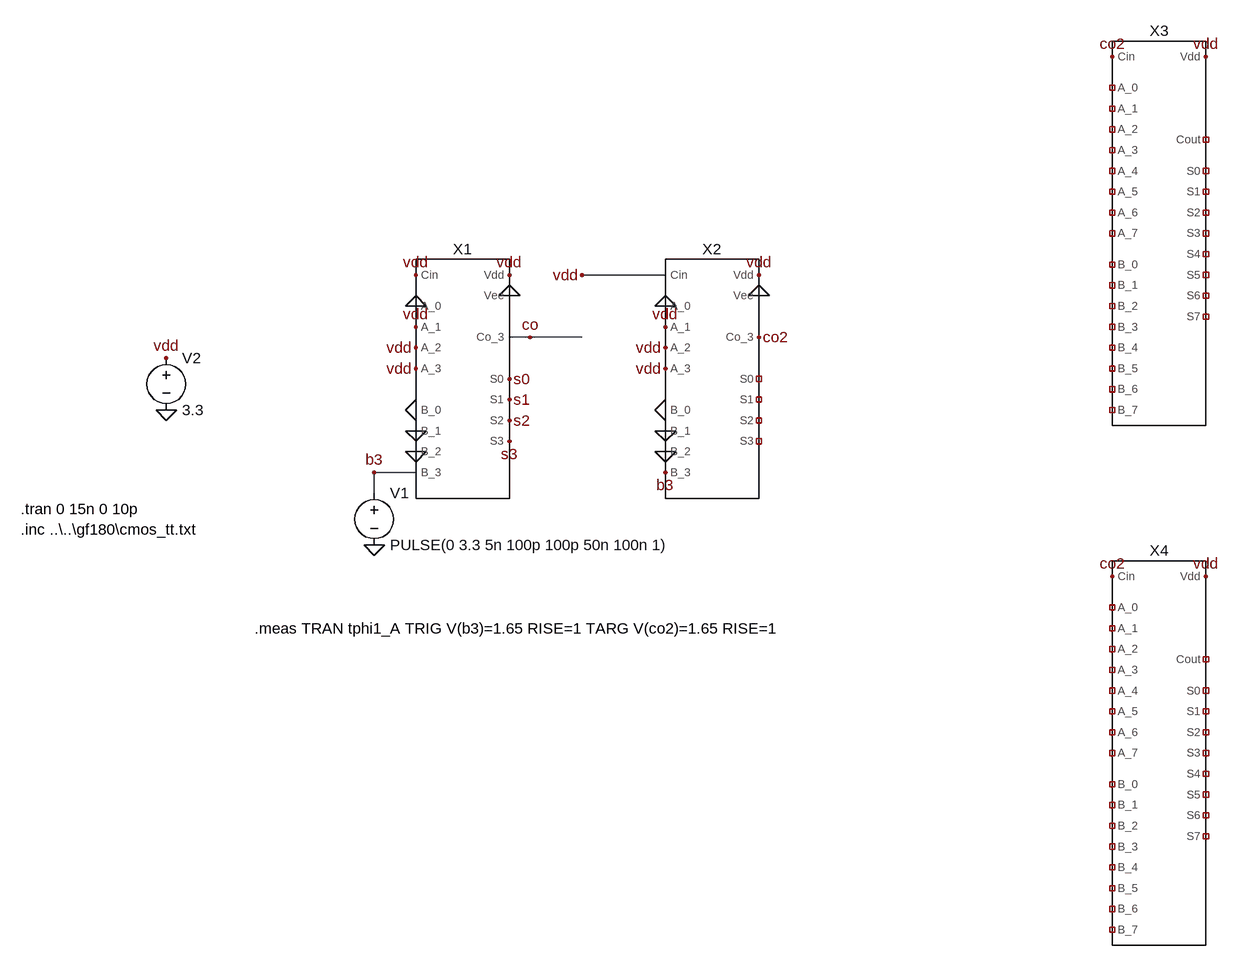
[diagram p0: schematic Draft4.asc]
Draft4.asc, the LTspice schematic file:
Version 4
SHEET 1 1308 988
WIRE 416 -48 288 -48
WIRE 208 48 176 48
WIRE 288 48 208 48
WIRE 32 256 -32 256
WIRE -32 288 -32 256
FLAG 176 -48 vdd
FLAG 176 -16 0
FLAG 208 48 co
FLAG 32 -48 vdd
FLAG 176 112 s0
FLAG 176 144 s1
FLAG 176 176 s2
FLAG 176 208 s3
FLAG 32 0 0
FLAG 32 32 vdd
FLAG 32 64 vdd
FLAG 32 96 vdd
FLAG 32 160 0
FLAG 32 192 0
FLAG 32 224 0
FLAG -32 368 0
FLAG -352 160 0
FLAG -352 80 vdd
FLAG 560 -48 vdd
FLAG 560 -16 0
FLAG 560 48 co2
FLAG 416 0 0
FLAG 416 32 vdd
FLAG 416 64 vdd
FLAG 416 96 vdd
FLAG 416 160 0
FLAG 416 192 0
FLAG 416 224 0
FLAG -32 256 b3
FLAG 416 256 b3
FLAG 288 -48 vdd
FLAG 1104 -384 co2
FLAG 1104 416 co2
FLAG 1248 -384 vdd
FLAG 1248 416 vdd
SYMBOL CLA-4bit 96 112 R0
SYMATTR InstName X1
SYMBOL voltage -32 272 R0
WINDOW 123 0 0 Left 0
WINDOW 39 0 0 Left 0
SYMATTR InstName V1
SYMATTR Value PULSE(0 3.3 5n 100p 100p 50n 100n 1)
SYMBOL voltage -352 64 R0
WINDOW 123 0 0 Left 0
WINDOW 39 0 0 Left 0
SYMATTR InstName V2
SYMATTR Value 3.3
SYMBOL CLA-4bit 480 112 R0
SYMATTR InstName X2
SYMBOL CLA-8bit 1168 -112 R0
SYMATTR InstName X3
SYMBOL CLA-8bit 1168 688 R0
SYMATTR InstName X4
TEXT -576 312 Left 2 !.tran 0 15n 0 10p
TEXT -576 344 Left 2 !.inc ..\\..\\gf180\\cmos_tt.txt
TEXT -216 496 Left 2 !.meas TRAN tphi1_A TRIG V(b3)=1.65 RISE=1 TARG V(co2)=1.65 RISE=1

The netlist it stands for:
* Draft4.asc
XX1 0 vdd vdd vdd 0 0 0 b3 vdd vdd 0 co s0 s1 s2 s3 CLA-4bit  ; pins A_0 A_1 A_2 A_3 B_0 B_1 B_2 B_3 Cin Vdd Vee Co_3 S0 S1 S2 S3
V1 b3 0 PULSE(0 3.3 5n 100p 100p 50n 100n 1)
V2 vdd 0 3.3
XX2 0 vdd vdd vdd 0 0 0 b3 vdd vdd 0 co2 NC_01 NC_02 NC_03 NC_04 CLA-4bit  ; pins A_0 A_1 A_2 A_3 B_0 B_1 B_2 B_3 Cin Vdd Vee Co_3 S0 S1 S2 S3
XX3 NC_05 NC_06 NC_07 NC_08 NC_09 NC_10 NC_11 NC_12 NC_13 NC_14 NC_15 NC_16 NC_17 NC_18 NC_19 NC_20 co2 vdd NC_21 NC_22 NC_23 NC_24 NC_25 NC_26 NC_27 NC_28 NC_29 CLA-8bit  ; pins A_0 A_1 A_2 A_3 A_4 A_5 A_6 A_7 B_0 B_1 B_2 B_3 B_4 B_5 B_6 B_7 Cin Vdd Cout S0 S1 S2 S3 S4 S5 S6 S7
XX4 NC_30 NC_31 NC_32 NC_33 NC_34 NC_35 NC_36 NC_37 NC_38 NC_39 NC_40 NC_41 NC_42 NC_43 NC_44 NC_45 co2 vdd NC_46 NC_47 NC_48 NC_49 NC_50 NC_51 NC_52 NC_53 NC_54 CLA-8bit  ; pins A_0 A_1 A_2 A_3 A_4 A_5 A_6 A_7 B_0 B_1 B_2 B_3 B_4 B_5 B_6 B_7 Cin Vdd Cout S0 S1 S2 S3 S4 S5 S6 S7
.tran 0 15n 0 10p
.inc ..\..\gf180\cmos_tt.txt
.meas TRAN tphi1_A TRIG V(b3)=1.65 RISE=1 TARG V(co2)=1.65 RISE=1
.backanno
.end